# EAGLE board Z_sim_v2 (EAGLE 6.5.0)
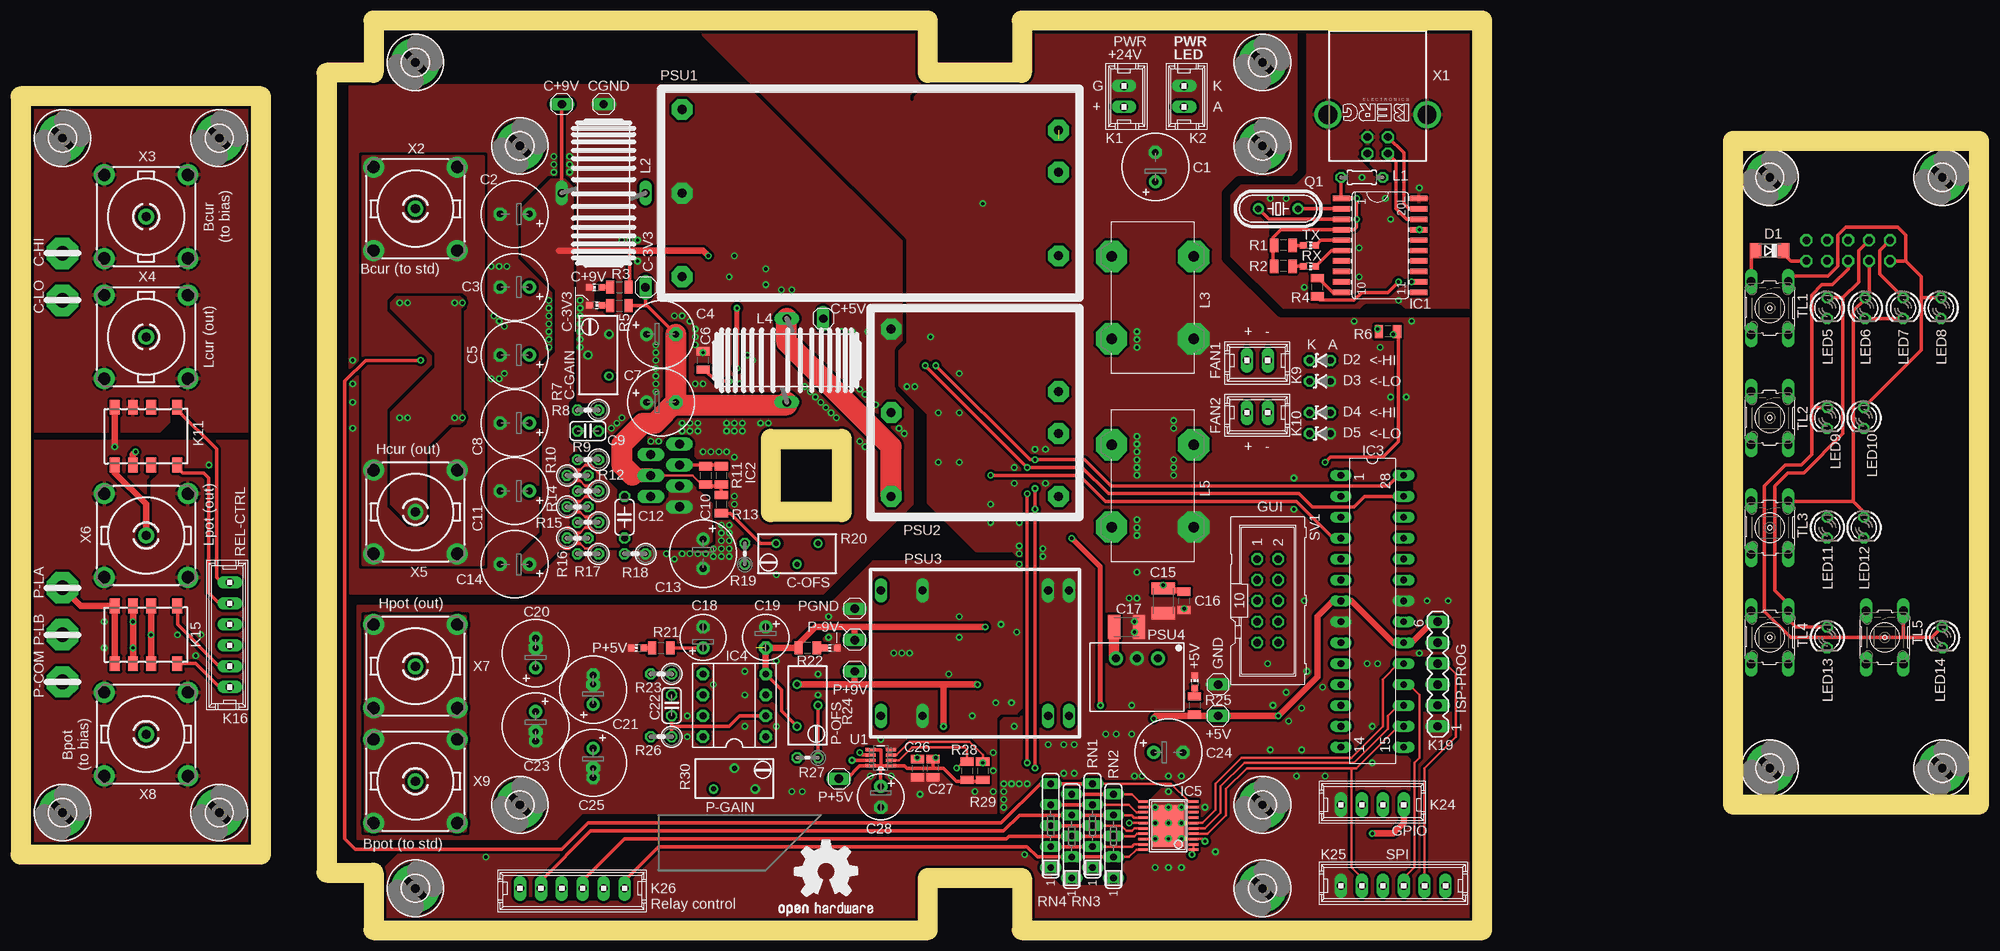
[diagram p2: board, top side]
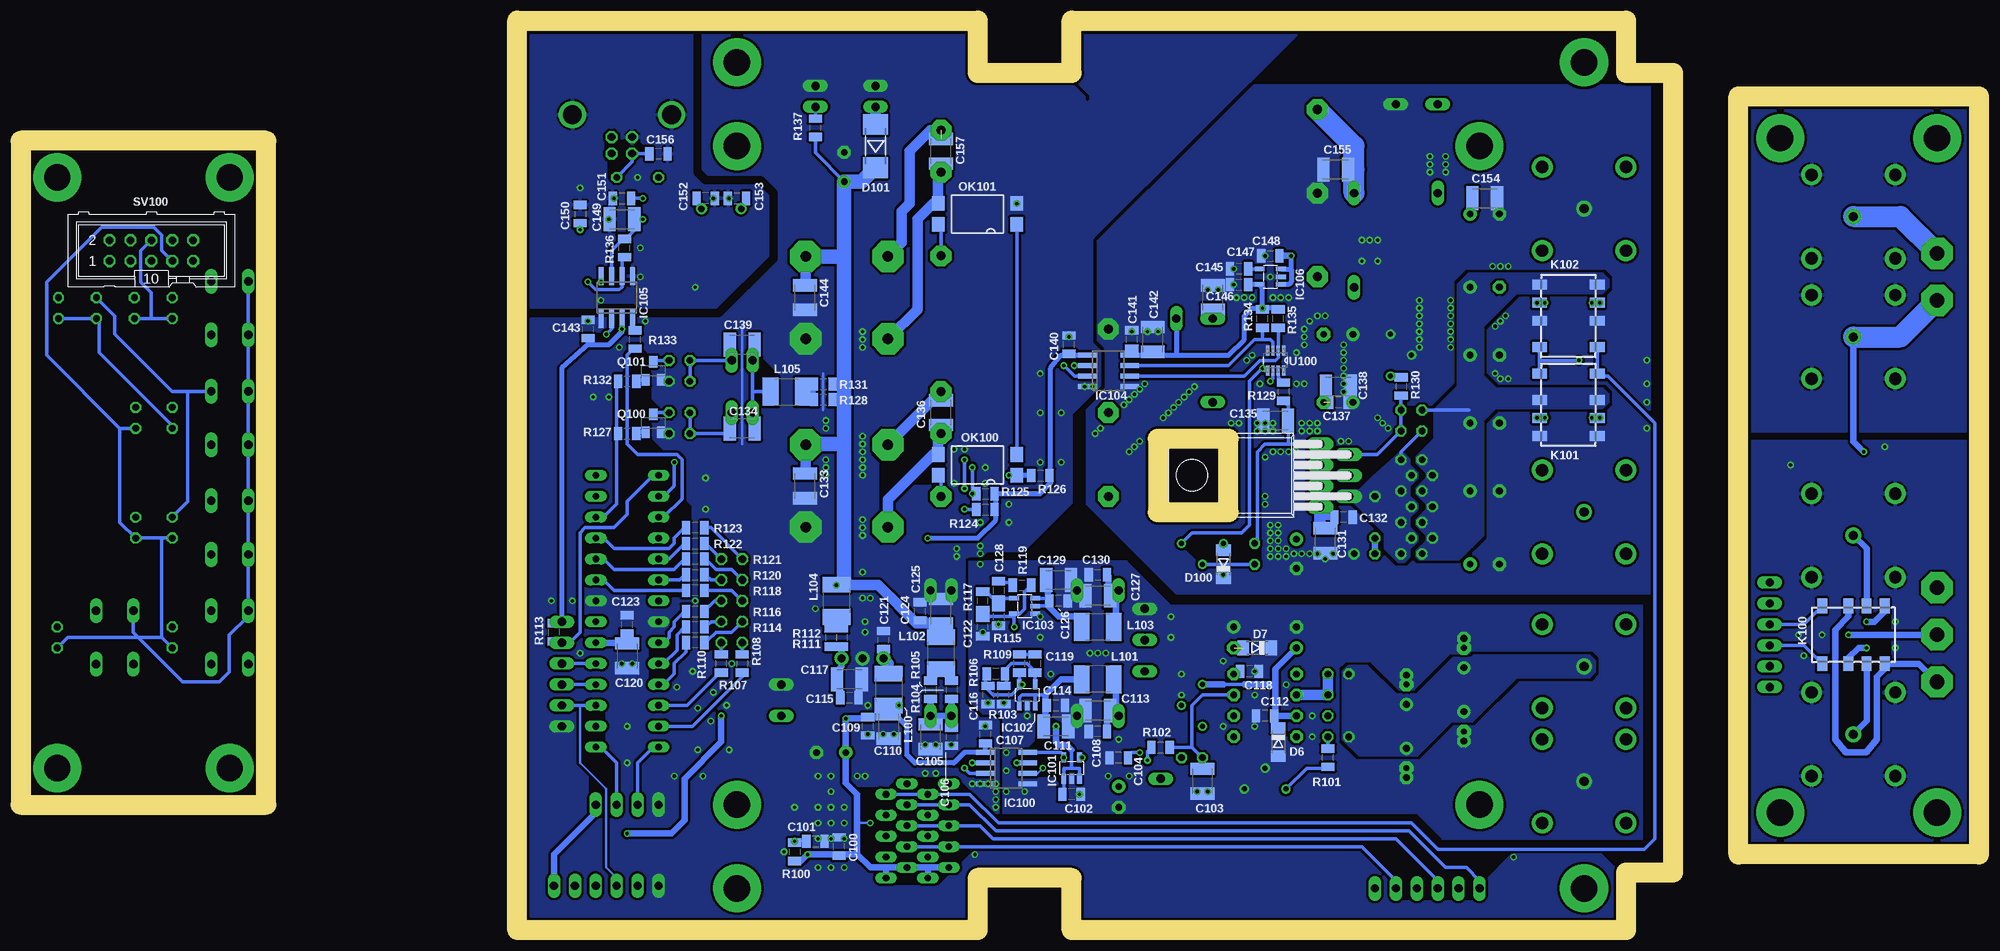
[diagram p3: board, bottom side, seen from below]

Size 237.81 x 110.49 mm. Coordinates in mm from the lower left corner, seen from the top.
Outline: 177.48,0 177.48,110.49 121.6,110.49 121.6,104.14 110.17,104.14 110.17,110.49 42.86,110.49 42.86,104.14 37.15,104.14 37.15,6.98 42.86,6.98 42.86,0 110.17,0 110.17,6.35 121.6,6.35 121.6,0 177.48,0
Outline: 91.12,59.69 99.7,59.69 99.7,50.8 91.12,50.8 91.12,59.69
Outline: 207.96,95.89 237.81,95.89 237.81,15.24 207.96,15.24 207.96,95.89
Outline: 29.21,9.21 29.21,101.28 0,101.28 0,9.21 29.21,9.21
Copper layers (1*16): Top 0.035mm / dielectric 1.5mm / Bottom 0.035mm
Design rules "default *": minimum track width 10mil, minimum drill 24mil, track to track 8mil, track to pad 8mil, pad to pad 8mil, via to via 8mil, smd to smd 8mil, copper to edge 12mil, drill to drill 8mil, minimum pad ring 10mil, minimum via ring 8mil, stop-mask expansion 4mil, vias tented up to drill 0mil, thermal gap 10mil
Net classes: 0 default: clearance 0.305 mm; 2 sup24v: clearance 0.457 mm; 3 zsim: clearance 0.305 mm
tRestrict: 75 lines
bRestrict: 89 lines

## Footprints (pad centres in the part's own frame; a part is rotated, then mirrored left to right if it is on the bottom)
E3,5-8 = drill 0.813 pad 1.6: + -1.778,0 | drill 0.813 pad 1.6 octagon: - 1.778,0
X0805 = smd 1 x 1.6: P$1 -1.111,0; P$2 1.111,0
C025-024X044 = drill 0.813 octagon: 1 -1.27,0; 2 1.27,0
C050-024X044 = drill 0.813 octagon: 1 -2.54,0; 2 2.54,0
C1210K = smd 1.5 x 2.9: 1 -1.5,0; 2 1.5,0
E2,5-6 = drill 0.813 pad 1.6: + -1.27,0 | drill 0.813 pad 1.6 octagon: - 1.27,0
SP = drill 1.016 pad 1.524 long: 1 0,0
FAST28_R = drill 1.778 pad 3.81 octagon: P$1 0,0
SOD80C = smd 1.4 x 1.8: A 1.7,0; C -1.7,0
ZDIO-2.5 = drill 0.813 octagon: A 1.27,0; C -1.27,0
MELF-MLL41 = smd 2.5 x 3: A 2.625,0; C -2.625,0
3,2-PAD = drill 3.2 pad 5.842: B3,2 0,0
SOIC20W = smd 0.66 x 2.032: 1 -6.35,-5.029; 2 -5.08,-5.029; 3 -3.81,-5.029; 4 -2.54,-5.029; 5 -1.27,-5.029; 6 0,-5.029; 7 1.27,-5.029; 8 2.54,-5.029; 9 3.81,-5.029; 10 5.08,-5.029; 11 5.08,4.394; 12 3.81,4.394; 13 2.54,4.394; 14 1.27,4.394; 15 0,4.394; 16 -1.27,4.394; 17 -2.54,4.394; 18 -3.81,4.394; 19 -5.08,4.394; 20 -6.35,4.394
TO220-7H = drill 1.1 long: 1 -3.81,-15.557; 2 -2.54,-19.05; 3 -1.27,-15.557; 4 0,-19.05; 5 1.27,-15.557; 6 2.54,-19.05; 7 3.81,-15.557
DIL28 = drill 0.813 long: 1 -16.51,-3.81; 2 -13.97,-3.81; 3 -11.43,-3.81; 4 -8.89,-3.81; 5 -6.35,-3.81; 6 -3.81,-3.81; 7 -1.27,-3.81; 8 1.27,-3.81; 9 3.81,-3.81; 10 6.35,-3.81; 11 8.89,-3.81; 12 11.43,-3.81; 13 13.97,-3.81; 14 16.51,-3.81; 15 16.51,3.81; 16 13.97,3.81; 17 11.43,3.81; 18 8.89,3.81; 19 6.35,3.81; 20 3.81,3.81; 21 1.27,3.81; 22 -1.27,3.81; 23 -3.81,3.81; 24 -6.35,3.81; 25 -8.89,3.81; 26 -11.43,3.81; 27 -13.97,3.81; 28 -16.51,3.81
DIL08 = drill 0.813 pad 1.5 octagon: 1 -3.81,-3.81; 2 -1.27,-3.81; 3 1.27,-3.81; 4 3.81,-3.81; 5 3.81,3.81; 6 1.27,3.81; 7 -1.27,3.81; 8 -3.81,3.81
TSSOP20 = smd 3.81 x 5.08: 0 0,0 | smd 1.194 x 0.305: 1 -3.048,2.925; 2 -3.048,2.275; 3 -3.048,1.625; 4 -3.048,0.975; 5 -3.048,0.325; 6 -3.048,-0.325; 7 -3.048,-0.975; 8 -3.048,-1.625; 9 -3.048,-2.275; 10 -3.048,-2.925; 11 3.048,-2.925; 12 3.048,-2.275; 13 3.048,-1.625; 14 3.048,-0.975; 15 3.048,-0.325; 16 3.048,0.325; 17 3.048,0.975; 18 3.048,1.625; 19 3.048,2.275; 20 3.048,2.925
SO8 = smd 0.6 x 2.2: 1 -1.905,-2.6; 2 -0.635,-2.6; 3 0.635,-2.6; 4 1.905,-2.6; 5 1.905,2.6; 6 0.635,2.6; 7 -0.635,2.6; 8 -1.905,2.6
SOT23-5 = smd 0.55 x 1.2: 1 -0.95,-1.3; 2 0,-1.3; 3 0.95,-1.3; 4 0.95,1.3; 5 -0.95,1.3
TE280370 = drill 1 long: 1 0,0; 2 2.54,0
G6KU-2F-Y = smd 1.2 x 1.8: 1 -3.8,-3.5; 2 -0.6,-3.5; 3 1.6,-3.5; 4 3.8,-3.5; 5 3.8,3.5; 6 1.6,3.5; 7 -0.6,3.5; 8 -3.8,3.5
TE280372 = drill 1 long: 1 -6.35,0; 2 -3.81,0; 3 -1.27,0; 4 1.27,0; 5 3.81,0; 6 6.35,0
SIL6 = drill 1.016 long: 1 -6.35,0; 2 -3.81,0; 3 -1.27,0; 4 1.27,0; 5 3.81,0; 6 6.35,0
TE280371 = drill 1 long: 1 -3.81,0; 2 -1.27,0; 3 1.27,0; 4 3.81,0
0204/5 = drill 0.813 octagon: 1 -2.54,0; 2 2.54,0
SFT830D = drill 1.016 long: 1 -5.08,0; 2 5.08,0
B1/2 = drill 1.27 pad 3.81 octagon: 1 -5,5; 2 -5,-5; 3 5,5; 4 5,-5
L1812 = smd 1.9 x 3.4: 1 -1.95,0; 2 1.95,0
CHIP-LED0603 = smd 0.8 x 0.8: A 0,-0.75; C 0,0.75
LED3MM = drill 0.813 octagon: A -1.27,0; K 1.27,0
SMD4-7 = smd 1.78 x 1.55: 1 -1.27,-4.77; 2 1.27,-4.77; 3 1.27,4.77; 4 -1.27,4.77
DCDC_AM30EW = drill 1.1 pad 2.54 octagon: 1 -22.86,-7.62; 2 -22.86,-2.54; 3 -22.86,7.62; 4 22.86,-10.16; 5 22.86,0; 6 22.86,10.16
DCDC_AM15EW = drill 1.1 pad 2.54 octagon: 1 2.54,-10.16; 2 -2.54,-10.16; 3 -10.16,-10.16; 4 10.16,10.16; 5 0,10.16; 6 -10.16,10.16
DCDC_XP_JCA_SYMOUT = drill 1 long: 2 -7.62,10.16; 3 -7.62,7.62; 9 -7.62,-7.62; 11 -7.62,-12.7; 14 7.62,-12.7; 16 7.62,-7.62; 22 7.62,7.62; 23 7.62,10.16
SIP3 = drill 1 pad 1.676: 1 -2.54,0; 2 0,0; 3 2.54,0
HC49/S = drill 0.813: 1 -2.413,0; 2 2.413,0
SOT23-BEC = smd 1 x 1.4: B -0.95,-1.1; C 0,1.1; E 0.95,-1.1
RTRIMT93YB = drill 0.61: 1 1.27,-2.54; 2 -1.27,0; 3 1.27,2.54
0207/2V = drill 0.813 octagon: 1 -1.27,0; 2 1.27,0
0204V = drill 0.813 octagon: 1 -1.27,0; 2 1.27,0
SIL5 = drill 0.813 long: 1 -5.08,0; 2 -2.54,0; 3 0,0; 4 2.54,0; 5 5.08,0
ML10 = drill 0.914 octagon: 1 -5.08,-1.27; 2 -5.08,1.27; 3 -2.54,-1.27; 4 -2.54,1.27; 5 0,-1.27; 6 0,1.27; 7 2.54,-1.27; 8 2.54,1.27; 9 5.08,-1.27; 10 5.08,1.27
CUDL1 = drill 1.016 long: 1 -3.251,2.261; 2 3.251,2.261; 3 -3.251,-2.261; 4 3.251,-2.261
SOT65P280X100-8N = smd 1.219 x 0.406: 1 -1.219,0.965; 2 -1.219,0.33; 3 -1.219,-0.33; 4 -1.219,-0.965; 5 1.219,-0.965; 6 1.219,-0.33; 7 1.219,0.33; 8 1.219,0.965
PN61729-S = drill 0.95 octagon: 1 1.25,4.71; 2 -1.25,4.71; 3 -1.25,2.71; 4 1.25,2.71 | drill 2.3 pad 2.9: S1 -6.02,0; S2 6.02,0
A1944 = drill 1.1 pad 1.93: 1 0,0 | drill 1.5 pad 2.54: 2 5.08,5.08; 3 -5.08,5.08; 4 -5.08,-5.08; 5 5.08,-5.08

## Placement (x,y rotation side)
C1  220u  [E3,5-8]  137.8,92.71 90 top
C2  470u  [E3,5-8]  60.01,87 180 top
C3  [E3,5-8]  60.01,78.11 180 top
C4  470u  [E3,5-8]  77.79,72.39 0 top
C5  [E3,5-8]  60.01,69.85 180 top
C6  1u  [X0805]  82.87,69.22 90 top
C7  470u  [E3,5-8]  77.79,64.14 0 top
C8  [E3,5-8]  60.01,61.59 180 top
C9  100p  [C025-024X044]  68.9,60.64 180 top
C10  100n  [X0805]  83.19,55.25 270 top
C11  4x470u  [E3,5-8]  60.01,53.34 180 top
C12  100n  [C050-024X044]  73.34,50.16 270 top
C13  470u  [E3,5-8]  82.87,45.72 270 top
C14  470u  [E3,5-8]  60.01,44.45 180 top
C15  10u  [C1210K]  138.75,40.01 270 top
C16  100n  [X0805]  141.29,40.01 270 top
C17  10u  [C1210K]  134.3,36.83 0 top
C18  100u  [E2,5-6]  82.87,35.56 90 top
C19  100u  [E2,5-6]  90.49,35.56 270 top
C20  [E3,5-8]  62.55,33.66 90 top
C21  [E3,5-8]  69.53,29.21 90 top
C22  100p  [C025-024X044]  79.06,27.3 90 top
C23  [E3,5-8]  62.55,24.77 270 top
C24  220u  [E3,5-8]  139.38,21.59 0 top
C25  4x470u  [E3,5-8]  69.53,20.32 270 top
C26  470p  [X0805]  108.9,19.69 270 top
C27  100n  [X0805]  110.81,19.69 90 top
C28  100u  [E2,5-6]  104.46,16.19 270 top
C100  100n  [X0805]  138.43,10.16 90 bottom
C101  100n  [X0805]  141.29,10.79 0 bottom
C102  100n  [X0805]  110.17,16.51 180 bottom
C103  10u  [C1210K]  94.3,18.1 270 bottom
C104  1u  [X0805]  104.46,20.95 180 bottom
C105  10u  [C1210K]  127.32,23.49 270 bottom
C106  100n  [X0805]  124.78,23.49 270 bottom
C107  100n  [X0805]  120.65,23.81 90 bottom
C108  100n  [X0805]  107,24.13 180 bottom
C109  100n  [X0805]  134.94,24.77 270 bottom
C110  10u  [C1210K]  132.4,24.77 270 bottom
C111  10u  [C1210K]  112.08,24.77 0 bottom
C112  100n  [X0805]  86.68,26.04 180 bottom
C113  10u  [C1210K]  107,26.67 180 bottom
C114  100n  [X0805]  112.08,27.3 0 bottom
C115  100n  [X0805]  137.16,28.26 0 bottom
C116  100n  [X0805]  120.33,28.58 270 bottom
C117  10u  [C1210K]  137.16,30.48 0 bottom
C118  100n  [X0805]  88.58,31.43 180 bottom
C119  1u  [X0805]  114.62,32.38 270 bottom
C120  10u  [C1210K]  164.15,33.34 270 bottom
C121  100n  [X0805]  133.03,35.24 90 bottom
C122  100n  [X0805]  120.97,36.83 90 bottom
C123  100n  [X0805]  164.15,37.15 90 bottom
C124  100n  [X0805]  128.59,38.73 90 bottom
C125  10u  [C1210K]  126.05,38.73 90 bottom
C126  100n  [X0805]  111.76,40.01 180 bottom
C127  10u  [C1210K]  107,40.64 0 bottom
C128  100n  [X0805]  119.06,41.27 270 bottom
C129  10u  [C1210K]  111.76,42.55 180 bottom
C130  100n  [X0805]  107,43.18 0 bottom
C131  10u  [C1210K]  79.38,47.31 270 bottom
C132  100n  [X0805]  77.15,50.16 180 bottom
C133  10u  [C1210K]  142.56,53.98 270 bottom
C134  10u  [C1210K]  150.18,60.96 0 bottom
C135  10u  [C1210K]  85.41,61.91 180 bottom
C136  10u  [C1210K]  126.05,62.87 270 bottom
C137  100n  [X0805]  77.79,64.14 0 bottom
C138  10u  [C1210K]  77.79,66.04 180 bottom
C139  10u  [C1210K]  150.18,71.12 0 bottom
C140  100n  [X0805]  110.49,71.12 90 bottom
C141  100n  [X0805]  102.87,71.75 90 bottom
C142  10u  [C1210K]  100.33,71.75 90 bottom
C143  100n  [X0805]  168.91,73.02 90 bottom
C144  10u  [C1210K]  142.56,76.84 270 bottom
C145  10u  [C1210K]  93.03,76.84 270 bottom
C146  100n  [X0805]  89.85,78.42 0 bottom
C147  470p  [X0805]  89.85,80.33 180 bottom
C148  100n  [X0805]  86.04,81.92 0 bottom
C149  4u7  [C1210K]  164.78,86.36 180 bottom
C150  100n  [X0805]  169.86,87 270 bottom
C151  100n  [X0805]  164.78,88.9 0 bottom
C152  12p  [X0805]  154.62,88.9 180 bottom
C153  12p  [X0805]  150.81,88.9 0 bottom
C154  10u  [C1210K]  60.01,88.9 0 bottom
C155  10u  [C1210K]  78.11,92.39 180 bottom
C156  100n  [X0805]  160.34,94.3 180 bottom
C157  10u  [C1210K]  126.05,94.61 270 bottom
C+5V  [SP]  97.47,74.3 0 top
C+9V  [SP]  65.72,100.33 270 top
C-3V3  [SP]  75.88,78.11 0 top
C-HI  [FAST28_R]  5.08,82.23 0 top
C-LO  [FAST28_R]  5.08,76.52 0 top
CGND  [SP]  70.8,100.33 270 top
D1  BAS32  [SOD80C]  212.41,82.55 180 top
D2  [ZDIO-2.5]  157.8,69.22 0 top
D3  [ZDIO-2.5]  157.8,66.67 0 top
D4  [ZDIO-2.5]  157.8,62.87 0 top
D5  [ZDIO-2.5]  157.8,60.33 0 top
D6  BAT42  [SOD80C]  85.09,22.86 270 bottom
D7  BAT42  [SOD80C]  87.63,34.29 180 bottom
D100  2V7  [SOD80C]  91.76,44.45 90 bottom
D101  [MELF-MLL41]  133.99,95.25 90 bottom
GOLD_ORB_SM1  OSHWLOGO_GOLD_ORB_MED  [OSHW1]  91.44,0 0 top
H1  MOUNT-PAD-ROUND3.2  [3,2-PAD]  47.94,105.41 0 top
H2  MOUNT-PAD-ROUND3.2  [3,2-PAD]  150.81,105.41 0 top
H3  MOUNT-PAD-ROUND3.2  [3,2-PAD]  5.08,96.2 0 top
H4  MOUNT-PAD-ROUND3.2  [3,2-PAD]  24.13,96.2 0 top
H5  MOUNT-PAD-ROUND3.2  [3,2-PAD]  60.64,95.25 0 top
H6  MOUNT-PAD-ROUND3.2  [3,2-PAD]  150.81,95.25 0 top
H7  MOUNT-PAD-ROUND3.2  [3,2-PAD]  212.41,91.44 0 top
H8  MOUNT-PAD-ROUND3.2  [3,2-PAD]  233.36,91.44 0 top
H9  MOUNT-PAD-ROUND3.2  [3,2-PAD]  212.41,19.69 0 top
H10  MOUNT-PAD-ROUND3.2  [3,2-PAD]  233.36,19.69 0 top
H11  MOUNT-PAD-ROUND3.2  [3,2-PAD]  60.64,15.24 0 top
H12  MOUNT-PAD-ROUND3.2  [3,2-PAD]  150.81,15.24 0 top
H13  MOUNT-PAD-ROUND3.2  [3,2-PAD]  5.08,14.29 0 top
H14  MOUNT-PAD-ROUND3.2  [3,2-PAD]  24.13,14.29 0 top
H15  MOUNT-PAD-ROUND3.2  [3,2-PAD]  47.94,5.08 0 top
H16  MOUNT-PAD-ROUND3.2  [3,2-PAD]  150.81,5.08 0 top
IC1  MCP2200S  [SOIC20W]  165.42,82.55 270 top
IC2  OPA548TH  [TO220-7H]  95.57,55.25 270 top
IC3  ATmega88  [DIL28]  164.15,38.73 270 top
IC4  OP211  [DIL08]  86.68,27.3 90 top
IC5  MAX4820  [TSSOP20]  139.38,12.7 180 top
IC100  ADUM1250  [SO8]  118.11,19.69 270 bottom
IC101  LP2985  [SOT23-5]  110.17,19.69 0 bottom
IC102  ADP7118AUJZ  [SOT23-5]  115.57,28.58 0 bottom
IC103  ADP7182AUJZ  [SOT23-5]  115.89,39.37 90 bottom
IC104  ADUM1250  [SO8]  105.73,67.94 270 bottom
IC105  ACSL-6210  [SO8]  165.42,76.84 0 bottom
IC106  LP2985  [SOT23-5]  86.04,79.38 90 bottom
K1  POWER  [TE280370]  133.99,102.55 270 top
K2  PWR LED  [TE280370]  141.29,102.55 270 top
K9  TE280370  [TE280370]  151.45,69.22 180 top
K10  TE280370  [TE280370]  151.45,62.87 180 top
K11  G6KU-2F-Y  [G6KU-2F-Y]  15.24,60.01 180 top
K15  G6KU-2F-Y  [G6KU-2F-Y]  15.24,35.88 180 top
K16  TE280372  [TE280372]  25.4,35.88 90 top
K19  ISP-prog  [SIL6]  172.08,31.12 90 top
K24  GPIO  [TE280371]  164.15,15.24 0 top
K25  SPI bus  [TE280372]  166.69,5.4 0 top
K26  RELAYS  [TE280372]  66.99,5.08 180 top
K100  G6KU-2F-Y  [G6KU-2F-Y]  15.24,35.88 0 bottom
K101  G6KU-2F-Y  [G6KU-2F-Y]  49.85,63.82 270 bottom
K102  G6KU-2F-Y  [G6KU-2F-Y]  49.85,74.61 90 bottom
L1  [0204/5]  162.88,91.44 180 top
L2  SFT830D  [SFT830D]  70.8,89.53 180 top
L3  [B1/2]  137.48,76.84 270 top
L4  SFT830D  [SFT830D]  93.03,69.22 270 top
L5  [B1/2]  137.48,53.98 270 top
L100  100u  [L1812]  132.4,29.21 270 bottom
L101  100u  [L1812]  107,30.48 180 bottom
L102  22u  [L1812]  126.05,33.66 270 bottom
L103  100u  [L1812]  107,36.83 180 bottom
L104  22u  [L1812]  138.75,40.01 270 bottom
L105  22u  [L1812]  144.78,65.41 0 bottom
LED1  [CHIP-LED0603]  156.53,83.19 270 top
LED2  [CHIP-LED0603]  156.53,80.64 270 top
LED3  [CHIP-LED0603]  69.85,78.11 90 top
LED4  [CHIP-LED0603]  69.85,75.88 270 top
LED5  [LED3MM]  219.39,75.56 270 top
LED6  [LED3MM]  224,75.56 270 top
LED7  [LED3MM]  228.6,75.56 270 top
LED8  [LED3MM]  233.2,75.56 270 top
LED9  [LED3MM]  219.39,62.23 270 top
LED10  [LED3MM]  223.84,62.23 270 top
LED11  [LED3MM]  219.39,48.9 270 top
LED12  [LED3MM]  223.84,48.9 270 top
LED13  [LED3MM]  219.39,35.56 270 top
LED14  [LED3MM]  233.36,35.56 270 top
LED15  [CHIP-LED0603]  74.93,34.29 90 top
LED16  [CHIP-LED0603]  98.42,34.29 90 top
LED17  [CHIP-LED0603]  142.56,30.16 0 top
M+5V  [SP]  145.42,26.04 90 top
MGND  [SP]  145.42,29.84 270 top
OK100  SFH618A-5X007  [SMD4-7]  121.6,56.52 90 bottom
OK101  SFH618A-5X007  [SMD4-7]  121.6,87 90 bottom
P+5V  [SP]  99.38,18.41 90 top
P+10V  [SP]  101.28,31.43 90 top
P-10V  [SP]  101.28,35.24 270 top
P-COM  [FAST28_R]  5.08,30.16 180 top
P-LA  [FAST28_R]  5.08,41.59 180 top
P-LB  [FAST28_R]  5.08,35.88 0 top
PGND  [SP]  101.28,39.05 270 top
PSU1  DCDC_AM30EW  [DCDC_AM30EW]  103.19,89.53 180 top
PSU2  DCDC_AM15EW  [DCDC_AM15EW]  115.89,62.87 90 top
PSU3  XP_JCA0224D03  [DCDC_XP_JCA_SYMOUT]  117.16,33.66 270 top
PSU4  R-78C5.0-1.0  [SIP3]  135.57,33.02 180 top
Q1  12MHz  [HC49/S]  152.72,87.63 0 top
Q100  BC817-16  [SOT23-BEC]  160.97,61.59 0 bottom
Q101  BC817-16  [SOT23-BEC]  160.97,67.94 0 bottom
R1  680  [X0805]  153.35,83.19 180 top
R2  680  [X0805]  153.35,80.64 180 top
R3  1k5  [X0805]  72.71,78.11 0 top
R4  560  [X0805]  157.48,78.11 90 top
R5  620  [X0805]  72.71,75.88 0 top
R6  1k  [X0805]  166.05,72.71 180 top
R7  500  [RTRIMT93YB]  70.17,69.85 0 top
R8  1k  [0207/2V]  68.9,63.18 180 top
R9  [0207/2V]  68.9,57.15 180 top
R10  [0207/2V]  67.63,55.25 0 top
R11  10k  [X0805]  85.09,55.25 270 top
R12  7x2R2  [0207/2V]  68.9,53.34 180 top
R13  1k  [X0805]  85.09,51.75 270 top
R14  [0207/2V]  67.63,51.44 0 top
R15  [0207/2V]  68.9,49.53 180 top
R16  [0207/2V]  67.63,47.62 0 top
R17  [0207/2V]  68.9,45.72 180 top
R18  10  [0207/2V]  74.61,45.72 180 top
R19  100k  [0204V]  87.95,45.72 90 top
R20  10k  [RTRIMT93YB]  94.3,45.72 90 top
R21  1k5  [X0805]  77.79,34.29 0 top
R22  1k5  [X0805]  95.57,34.29 180 top
R23  51  [0207/2V]  77.79,31.12 180 top
R24  50k  [RTRIMT93YB]  95.57,27.3 180 top
R25  620  [X0805]  142.56,27.3 270 top
R26  1k  [0207/2V]  77.79,23.49 180 top
R27  100k  [0204V]  95.57,20.95 180 top
R28  2k2  [X0805]  114.94,19.37 270 top
R29  2k2  [X0805]  116.84,19.37 270 top
R30  500  [RTRIMT93YB]  86.68,18.41 270 top
R100  1k  [X0805]  143.83,9.53 270 bottom
R101  510  [X0805]  79.06,20.95 90 bottom
R102  1k  [X0805]  99.38,22.23 0 bottom
R103  11k  [X0805]  118.43,28.58 90 bottom
R104  2R2  [X0805]  127.32,29.21 270 bottom
R105  2R2  [X0805]  124.78,29.21 270 bottom
R106  100k  [X0805]  119.38,31.12 180 bottom
R107  5x33R  [X0805]  152.72,32.38 90 bottom
R108  [X0805]  150.18,32.38 270 bottom
R109  1k  [X0805]  116.52,32.38 90 bottom
R110  [X0805]  155.89,34.92 180 bottom
R111  2R2  [X0805]  139.38,35.56 270 bottom
R112  2R2  [X0805]  138.11,35.56 270 bottom
R113  1k  [X0805]  173.04,36.2 90 bottom
R114  [X0805]  155.89,36.83 0 bottom
R115  11k  [X0805]  119.06,38.1 270 bottom
R116  [X0805]  155.89,38.73 0 bottom
R117  100k  [X0805]  120.97,40.01 90 bottom
R118  [X0805]  155.89,41.27 180 bottom
R119  12k  [X0805]  116.2,41.91 0 bottom
R120  [X0805]  155.89,43.18 0 bottom
R121  [X0805]  155.89,45.09 180 bottom
R122  [X0805]  155.89,46.99 0 bottom
R123  5x33R  [X0805]  155.89,48.9 180 bottom
R124  2k2  [X0805]  120.65,51.12 0 bottom
R125  2k2  [X0805]  120.65,53.02 0 bottom
R126  430  [X0805]  113.98,55.25 0 bottom
R127  10k  [X0805]  164.15,60.33 0 bottom
R128  2R2  [X0805]  140.33,64.45 0 bottom
R129  1k  [X0805]  84.45,65.41 270 bottom
R130  510  [X0805]  70.17,66.04 270 bottom
R131  2R2  [X0805]  140.33,66.36 0 bottom
R132  10k  [X0805]  164.15,66.67 0 bottom
R133  560  [X0805]  163.19,71.75 90 bottom
R134  2k2  [X0805]  87,74.3 90 bottom
R135  2k2  [X0805]  85.09,74.3 90 bottom
R136  560  [X0805]  164.46,82.87 90 bottom
R137  4k7  [X0805]  141.29,97.47 90 bottom
RN1  4x50  [SIL5]  130.18,12.7 90 top
RN2  4x50  [SIL5]  132.72,11.43 90 top
RN3  4x50  [SIL5]  127.64,11.43 90 top
RN4  4x50  [SIL5]  125.09,12.7 90 top
SV1  CONTROLS  [ML10]  151.45,40.01 270 top
SV100  CONTROLS  [ML10]  221.93,82.55 0 bottom
TL1  CUDL1_A  [CUDL1]  212.41,75.56 270 top
TL2  CUDL1_A  [CUDL1]  212.41,62.23 270 top
TL3  CUDL1_A  [CUDL1]  212.41,48.9 270 top
TL4  CUDL1_A  [CUDL1]  212.41,35.56 270 top
TL5  CUDL1_A  [CUDL1]  226.38,35.56 270 top
U1  LTC2631  [SOT65P280X100-8N]  104.46,20.95 180 top
U100  LTC2631  [SOT65P280X100-8N]  85.41,69.22 270 bottom
X1  PN61729-S  [PN61729-S]  164.78,99.06 180 top
X2  Bcur  [A1944]  47.94,87.63 0 top
X3  Bcur  [A1944]  15.24,86.68 270 top
X4  Lcur  [A1944]  15.24,72.07 270 top
X5  Hcur  [A1944]  47.94,50.8 0 top
X6  Lpot  [A1944]  15.24,47.94 180 top
X7  Hpot  [A1944]  47.94,32.07 0 top
X8  Bpot  [A1944]  15.24,23.81 180 top
X9  Bpot  [A1944]  47.94,18.1 0 top

## Tracks (layer width: path | path; a pad name or v marks a point on that pad's centre or on a via)
+5V  (via drill 0.4)
  Top 0.305: IC5.2 IC5.1 142.43,9.34 v142.24,9.21 | IC5.15 135.58,13.03 v134.62,13.02
  Top 0.406: R6.P$2 164.78,73.18 v164.78,73.02
  Top 0.61: v131.13,27.3 131.13,44.13 v127.64,47.62
  Top 0.813: K19.6 171.45,37.47 168.91,34.92 IC3.20 166.69,34.92 161.61,40.01 IC3.7 159.39,40.01 157.48,38.1 157.48,30.8 v152.72,26.04 M+5V.1 142.56,26.04 | v164.15,11.75 166.69,11.75 167.96,13.02 K24.4 | 142.56,26.04 137.8,26.04 137.6,25.84 v137.6,25.72 | R25.P$2 142.56,26.04
  Bottom 0.305: v134.62,13.02 135.89,13.02 136.21,13.34 | C100.P$1 138.11,9.05 138.11,9.21
  Bottom 0.406: R113.P$2 172.88,37.47 K19.6
  Bottom 0.61: C110.1 132.17,26.04 131.45,26.04 130.17,24.77 130.17,21.27 129.22,20.32 124.46,20.32 123.19,21.59 IC100.1 120.65,21.65 C107.P$1 | L100.2 131.17,27.26 v131.13,27.3 | v127.64,47.62 121.6,47.62 119.38,49.85 119.38,51.12 | R124.P$2 119.38,51.12 | 119.38,51.12 119.38,53.02 R125.P$2 113.98,53.02 112.71,54.29 112.71,55.09 R126.P$2 112.71,55.25 112.71,68.26 111.44,69.85 110.81,69.85 | 110.81,69.85 IC104.1 | C140.P$1 110.65,70.01 110.81,69.85 | IC105.3 v164.78,73.02 164.78,72.71 166.37,71.12 168.91,71.12 | 168.91,71.12 172.08,68.26 K19.6 | C143.P$1 168.91,71.12
  Bottom 0.813: L100.2 C110.1 132.79,25.88 C109.P$1 134.94,25.72 137.48,25.72 137.6,25.59 | K25.6 173.04,9.21 167.96,14.29 K24.4 | 136.21,9.21 136.21,13.34 136.21,16.51 137.6,17.91 C24.+ 137.6,25.59 | 136.21,9.21 138.11,9.21 v142.24,9.21 143.03,8.41 R100.P$2 | 132.72,7.62 RN1.1 127.64,7.62 | 132.72,7.62 134.62,7.62 136.21,9.21 | RN2.1 132.72,7.62 | v152.72,26.04 152.72,22.86 157.16,18.41 157.16,13.34 158.75,11.75 v164.15,11.75 | v137.6,25.72 137.6,25.59 | IC3.20 164.15,34.92 C120.1 C123.P$1 | RN4.1 127.64,7.62 | RN3.1 127.64,7.62
+5V/1  (via drill 0.4)
  Top 0.406: 110.81,19.69 107.63,19.69 107.33,19.99 U1.1 104.44,19.99 | 110.81,19.69 C27.P$2 v111.12,20.95 | R29.P$2 116.84,18.1 115.09,18.1 R28.P$2 114.46,18.26 114.3,18.1 113.67,18.1 112.08,19.69 110.81,19.69 | 104.44,19.99 U1.8 101.9,19.99 100.33,18.41 P+5V.1 | 104.44,19.99 104.46,20 104.46,21.91 103.25,21.91 U1.5 | 104.44,19.99 104.44,17.48 C28.+
  Bottom 0.406: IC100.8 111.44,21.59 111.12,21.27 IC101.5 111.09,20.98 v111.12,20.95
+5V/2  (via drill 0.4)
  Top 0.61: v87,68.26 v87,75.56
  Bottom 0.406: C146.P$2 | U100.5 86.73,68 v87,68.26 88.58,66.67 88.58,49.21 89.53,48.26 95.57,48.26 R20.1
  Bottom 0.61: C146.P$2 IC106.5 87,78.08 v87,75.56 | R135.P$2 85.09,75.56 v87,75.56 | R134.P$2 v87,75.56 | 100.33,69.85 IC104.8 102.87,70.11 C141.P$1 | 100.33,69.85 97.47,69.85 | 97.47,69.85 91.12,69.85 89.22,71.75 89.22,74.61 88.27,75.56 v87,75.56 | C142.1 100.33,69.85 | C+5V.1 97.47,69.85
+9V  (via drill 0.4)
  Top 0.305: 69.85,46.99 69.22,46.36 68.58,46.36 67.94,46.99 67.63,46.99 | 67.63,46.99 67.31,46.99 66.67,46.36 66.04,46.36 65.41,46.99 | 69.85,52.07 69.22,52.7 68.9,52.7 | 68.9,52.7 68.58,52.7 67.94,52.07 67.63,52.07 | 67.63,52.07 67.31,52.07 66.67,52.7 | 66.36,48.9 66.67,48.9 67.31,48.26 67.63,48.26 | 67.63,48.26 67.94,48.26 68.58,48.9 68.9,48.9 | 68.9,48.9 69.22,48.9 69.85,48.26 | 66.36,50.16 66.67,50.16 67.31,50.8 67.63,50.8 | 67.63,50.8 67.94,50.8 68.58,50.16 68.9,50.16 | 68.9,50.16 69.22,50.16 69.85,50.8 | 68.9,48.9 68.9,50.16 | 67.63,52.07 67.63,50.8 | 66.67,53.98 67.31,54.61 67.63,54.61 | 67.63,54.61 67.94,54.61 68.58,53.98 68.9,53.98 | 68.9,53.98 69.22,53.98 69.85,54.61 | 68.9,52.7 68.9,53.98 | 70.17,55.56 69.22,56.52 68.58,56.52 67.94,55.88 67.63,55.88 | 67.63,55.88 67.31,55.88 66.67,56.52 | 67.63,54.61 67.63,55.88 | 67.63,46.99 67.63,48.26
  Top 0.406: R3.P$2 73.98,78.11 73.98,82.55 | C+9V.1 L2.2
  Top 0.813: v83.5,81.92 82.87,82.55 73.98,82.55 65.41,82.55
  Bottom 0.61: 83.5,80.33 83.5,78.74 83.82,78.42 IC106.1 | IC106.3 83.5,80.33 | 83.5,80.33 v83.5,81.92
  Bottom 0.813: C132.P$2 80.01,50.16 | C148.P$2 v83.5,81.92 | C2.+ 61.79,88.62 C154.1
  Bottom 1.422: C131.1 79.92,48.81 80.01,48.9 80.01,50.16 IC2.5
  pour Top (no thermals): 80.96,54.61 79.06,54.61 78.42,53.98 73.03,51.75 72.39,52.39 72.39,53.34 66.36,59.37 66.36,64.14 66.99,64.77 66.99,90.17 66.04,91.12 64.45,91.12 60.96,87.63 60.96,81.92 65.09,77.79 65.09,70.17 63.5,68.58 63.5,47.94 60.96,45.4 60.96,43.82 61.28,43.5 62.55,43.5 65.41,46.36 66.67,46.36 66.99,46.67 83.19,46.67 83.82,47.31 83.82,51.75
+10V  (via drill 0.4)
  Top 0.406: C18.+ R21.P$2
  Top 0.813: R24.1 101.28,29.84 | 101.28,29.84 112.08,29.84 | 112.08,29.84 v116.2,29.84 | v112.08,24.77 112.08,29.84 | P+10V.1 101.28,29.84
  Bottom 0.406: v116.2,29.84 116.23,29.88 IC102.5 | 111.12,19.68 IC101.1 111.12,16.67 C102.P$2 | 111.12,19.68 111.12,19.69 110.17,19.69 | 110.17,19.69 109.22,19.69 IC101.3 | 111.12,19.68 110.17,19.68 110.17,19.69 | 110.17,19.69 110.17,21.91 | 91.76,29.84 89.22,29.84 | IC102.5 116.52,29.53 117.47,28.58 119.7,28.58 120.33,29.21 C116.P$1 120.49,29.69 120.65,29.84 120.65,30.96 R106.P$2 | IC102.5 R109.P$1
  Bottom 0.813: 110.17,21.91 110.81,22.54 111.76,22.54 112.08,22.86 v112.08,24.77 | R24.1 91.76,29.84 | 89.22,29.84 85.41,29.84 | 85.41,29.84 85.41,26.67 85.41,26.04 | 85.41,26.04 IC4.7 | C112.P$1 85.41,26.04 | 85.41,29.84 85.41,31.75 C18.+ | D6.C 85.41,24.56 85.41,26.04
-5V  (1 unrouted)
  Top 0.305: IC2.4 81.6,55.25 82.71,54.13 C10.P$2
  Top 0.406: R5.P$2 75.88,75.88 | 75.88,75.88 76.07,75.88 C4.- | C10.P$2 83.19,53.98 85.09,53.98 R11.P$2 R13.P$1 | C-3V3.1 75.88,75.88
  Top 1.676: IC2.4 74.3,55.25
  Top 2.54: 74.3,55.25 73.02,56.52 73.02,59.05 75.56,61.59 77.03,61.59 C7.- | C4.- C7.- | C7.- 79.69,64.14 79.69,63.82 93.03,63.82 L4.2
  Bottom 0.61: C138.2 79.57,65.76 C7.-
-10V  (via drill 0.4)  (1 unrouted)
  Top 0.406: R24.3 92.39,26.67 92.39,29.21 IC4.4
  Top 0.813: IC4.4 C19.- 93.98,34.29 | 93.98,34.29 96.52,36.83 101.28,36.83 | 101.28,36.83 v117.16,36.83 | R22.P$2 93.98,34.29 | P-10V.1 101.28,36.83
  Bottom 0.305: v117.16,36.83 117.19,36.86
  Bottom 0.406: 117.19,36.86 IC103.5 | IC103.5 116.52,38.42 115.89,39.05 115.89,41.12 R119.P$2 | IC103.5 117.19,38.13 117.16,38.1 120.81,38.1 C122.P$2 R117.P$1
  Bottom 0.813: IC4.4 89.69,31.12 C118.P$2
B0
  Bottom 0.406: R108.P$2 150.34,31.12 149.86,31.12 156.21,24.77 IC3.13
B1
  Bottom 0.406: R107.P$1 152.88,31.12 153.04,31.12 156.85,27.3 IC3.12
D0
  Bottom 0.406: R123.P$2 157.16,48.9 158.43,47.62 158.43,46.99 159.07,46.36 165.73,46.36 167.01,47.62 IC3.25
D1
  Bottom 0.406: R122.P$1 157.16,46.99 159.07,45.09 IC3.5
D2
  Bottom 0.406: R121.P$2 157.16,45.09 158.43,43.82 165.73,43.82 167.01,45.09 IC3.24
D3
  Bottom 0.406: R120.P$1 157.16,43.18 157.8,42.55 IC3.6
D4
  Bottom 0.406: R118.P$2 165.73,41.27 167.01,42.55 IC3.23
FAN
  Bottom 0.406: IC3.26 167.01,50.16 165.42,51.75 165.42,60.33 | R127.P$1 165.42,60.33 | 165.42,60.33 165.42,66.67 R132.P$1
GND  (via drill 0.4)
  Top 0.305: IC5.12 137.74,14.97 arc-90 v137.8,14.92 | IC5.9 141.02,14.97 arc90 v140.97,14.92 | IC5.18 137.76,11.07 arc90 v137.8,11.11
  Bottom 0.305: 140.33,63.18 140.33,67.63 | 150.18,59.05 150.18,73.34
  other vias: 139.38,14.92 140.97,11.11 139.38,11.11 139.38,13.02 137.8,13.02 140.97,13.02 168.91,73.98 165.1,70.8 166.37,64.77 168.27,64.77 135.57,71.75 135.57,72.71 135.57,70.8 135.57,48.9 135.57,49.85 135.57,47.94 154.62,51.12 154.62,54.93 141.29,39.05 134.94,23.81 131.76,23.81 133.03,23.81 143.83,14.92 153.99,25.4 152.08,27.3 156.21,31.43 158.12,29.53 155.57,21.91 158.43,18.73 154.94,18.73 151.76,21.91 121.28,17.78 119.38,15.88 120.65,24.77 124.78,22.54 126.68,22.54 127.95,22.54 124.14,46.36 124.14,45.4 121.28,46.67 121.28,45.72 120.65,54.29 121.28,49.53 120.65,56.2 123.19,58.42 124.46,54.29 124.46,58.42 108.58,66.04 107.63,66.04 110.49,72.07 113.98,67.63 113.98,62.87 169.86,33.66 163.51,32.38 164.78,32.38 137.8,7.62 139.38,7.62 140.97,7.62 116.84,88.27 139.38,18.73 140.97,18.73 136.21,18.73 135.25,18.73 139.38,16.83 170.81,40.01 155.89,40.01 173.36,40.01 134.94,27.3 164.15,20.32 164.15,24.77 155.57,26.99 153.67,28.89 151.45,32.38 135.25,36.2 135.25,37.47 127.95,19.05 126.68,19.05 122.24,17.78 145.1,9.53 121.92,9.21 119.38,14.92 119.38,16.83 56.52,8.89 117.79,51.75 117.79,49.53 113.98,56.83 111.44,56.83 111.44,62.87 135.57,55.25 135.57,56.2 135.57,57.15 135.57,58.1 135.57,59.05 135.57,60.01 140.02,55.25 140.02,56.2 140.02,57.15 140.02,60.96 140.02,61.91 135.57,43.5 135.57,40.32 134.62,40.32 161.93,73.98 120.33,17.78 119.38,17.78
  pour Bottom (rank 4, no thermals): 38.42,108.9 38.42,109.22 176.21,109.22 176.21,1.27 38.42,1.27
  pour Top (rank 4, no thermals): 176.21,1.27 38.42,1.27 38.42,109.22 176.21,109.22
GND1  (via drill 0.4, 0.7 pad 1.68)
  other vias: 87.95,31.43 87.95,28.58 87.95,24.77 120.97,36.2 119.06,37.15 113.98,38.1 113.98,35.56 115.57,26.04 112.71,31.12 118.43,27.62 120.33,27.62 104.46,23.18 105.73,18.73 103.19,18.73 109.22,16.51 115.89,16.83 118.11,21.59 107,33.66 106.05,33.66 107.95,33.66 121.28,44.45 69.53,29.84 62.55,34.29 62.55,24.13 69.53,19.69 118.11,19.37 118.11,16.83 91.76,32.7 91.76,24.77 84.14,29.84 80.96,23.49 80.96,26.04 93.66,16.83 94.93,16.83 96.84,28.58 96.84,31.12 98.11,35.56 98.11,38.1
  pour Bottom (rank 2, no thermals): 40.96,39.37 98.11,39.37 103.5,44.77 122.56,44.77 122.56,27.94 120.97,26.35 119.06,26.35 118.43,25.72 118.43,14.29 68.26,14.29 65.09,11.11 40.96,11.11
  pour Top (rank 2, no thermals): 40.96,39.37 98.11,39.37 103.5,44.77 122.56,44.77 122.56,27.94 120.97,26.35 119.06,26.35 118.43,25.72 118.43,14.29 68.26,14.29 65.09,11.11 40.96,11.11
GND2  (via drill 0.4)
  other vias: 102.87,72.71 100.97,72.71 99.7,72.71 92.39,77.79 93.66,77.79 90.49,78.42 90.49,80.33 86.68,81.92 82.87,70.17 88.27,69.85 87.31,66.36 81.92,66.36 85.72,61.59 86.68,61.59 86.68,60.64 85.72,60.64 82.23,61.59 82.23,60.64 81.28,60.64 81.28,61.59 89.85,61.59 91.76,43.18 76.52,59.37 78.42,45.72 80.33,45.72 79.38,45.09 85.72,58.1 84.77,58.1 83.82,58.1 82.87,58.1 85.09,49.21 86.04,49.21 85.09,48.26 86.04,48.26 64.13,70.8 64.13,71.75 64.13,72.71 64.13,73.66 64.13,74.61 64.13,75.56 64.13,76.52 58.1,80.64 57.15,80.64 59.05,80.64 58.1,73.98 57.47,74.61 58.74,73.34 58.1,66.99 57.15,66.99 58.74,67.63 67.94,76.52 67.94,75.56 67.94,74.61 67.94,73.66 67.94,72.71 67.94,71.75 67.94,70.8 77.15,65.41 77.15,66.36 77.15,67.31 77.15,68.26 77.15,69.22 77.15,70.17 77.15,71.12 88.27,76.84 85.72,76.84 84.77,76.84 83.82,76.84 89.22,76.84 90.17,76.84 95.25,66.04 95.89,65.41 96.52,64.77 97.16,64.14 97.79,63.5 98.42,62.87 99.06,62.23 101.28,66.36 101.92,65.72 102.55,65.09 103.19,64.45 103.82,63.82 81.92,71.12 81.92,72.07 81.92,73.02 81.28,73.98 80.33,74.61 79.38,74.61 71.75,60.96 72.39,61.59 73.03,62.23 86.68,51.75 101.92,59.37 102.55,58.74 103.19,58.1 106.68,60.96 107.31,60.33 88.9,69.22 40.32,69.22 74.93,81.28 73.03,81.28 73.03,83.82 73.98,83.82 74.93,83.82 64.77,92.08 66.67,92.08 66.67,93.03 64.77,93.03 64.77,93.98 66.67,93.98 40.32,66.36 40.32,64.14 40.32,60.96 77.47,59.37 86.68,57.47 87.63,60.64 87.63,61.59 90.81,61.59 86.68,52.7 85.09,47.31 86.04,47.31 85.09,46.36 86.04,46.36 84.14,46.36 84.14,45.4 85.09,45.4 86.04,45.4 83.19,45.72 82.23,45.72 81.28,45.72 80.33,61.59 80.33,60.64 82.87,66.36 86.04,79.38
  pour Top (rank 3, no thermals): 40,40.96 97.47,40.96 108.27,51.75 108.27,63.18 106.05,65.41 106.05,70.8 107.95,72.71 107.95,102.55 40,102.55
  pour Bottom (rank 3, no thermals): 40,40.96 97.47,40.96 108.27,51.75 108.27,63.18 106.05,65.41 106.05,70.8 107.95,72.71 107.95,102.55 40,102.55
GPIO0
  Bottom 0.406: IC3.14 160.97,22.23 162.88,20.32 K24.2
GPIO1
  Bottom 0.406: K24.3 165.42,20.32 167.32,22.23 IC3.15
L0
  Bottom 0.406: R116.P$1 157.16,38.73 158.43,37.47 158.43,36.83 159.07,36.2 159.07,35.56 159.7,34.92 IC3.9
L1
  Bottom 0.406: R110.P$2 157,33.81 158.43,32.38 158.43,31.12 159.7,29.84 IC3.11
L2
  Bottom 0.406: R114.P$1 157.16,36.83 158.11,35.88 158.11,33.97 159.7,32.38 IC3.10
MISO
  Top 0.305: K25.4 167.96,6.35 169.23,7.62 169.23,20.32 169.86,20.95 169.86,28.58 168.59,29.84 IC3.18
  Bottom 0.406: IC3.18 K19.3
MOSI
  Top 0.305: IC5.5 143.82,12.38 145.73,14.29 145.73,17.46 148.59,20.32 161.92,20.32 166.05,24.45 166.05,26.04 167.32,27.3 IC3.17 168.91,27.3
  Bottom 0.305: K25.3 165.42,6.35 166.69,7.62 166.69,17.14 169.86,20.32 169.86,27.3
  Bottom 0.406: IC3.17 169.86,27.3 K19.2
N$1
  Top 0.406: R11.P$1 85.09,56.52 83.19,56.52 | 83.19,56.52 IC2.3 | C10.P$1 83.19,56.52
N$2
  Bottom 0.406: OK100.4 126.05,54.92 PSU2.3
N$3
  Bottom 0.406: R19.2 87.63,47.31 87.63,58.1 86.68,59.05 83.82,59.05 | 83.82,59.05 IC2.1 | 83.82,59.05 83.82,61.91 C135.1 83.82,62 83.82,63.66 R129.P$2
N$4
  Bottom 1.27: L5.2 PSU2.1 C136.1
N$5
  Bottom 0.406: R20.2 R19.1
N$6
  Bottom 0.406: R8.2 61.91,63.18
  pour Bottom (no thermals): 66.99,47.31 66.99,47.94 68.26,49.21 68.26,49.85 66.99,51.12 66.99,51.75 68.26,53.02 68.26,53.66 66.99,54.93 66.99,55.56 68.26,56.83 68.26,57.47 66.04,59.69 66.04,63.18 63.18,66.04 63.18,78.42 61.91,79.69 45.72,79.69 45.09,79.06 45.09,78.11 45.72,77.47 56.2,77.47 60.33,73.34 60.33,67.31 58.74,65.72 45.72,65.72 45.09,65.09 45.09,64.14 45.72,63.5 58.74,63.5 60.33,61.91 60.33,47.94 63.18,45.09 67.94,45.09 68.26,45.4 68.26,46.04
N$7
  Bottom 0.813: C12.2 R18.2
N$8
  Bottom 1.27: L5.4 132.48,52.31 127,57.79 OK100.3 126.37,60 PSU2.2 C136.2
N$9
  Bottom 0.406: U100.7 85.08,67.14 R129.P$1
N$10
  Bottom 0.406: IC2.2 73.02,57.79 C9.1 R8.1 R130.P$2
N$11
  Bottom 0.406: R7.1 70.33,67.31 R130.P$1
N$12
  Top 0.406: R20.3 89.85,46.99 86.2,50.64 R13.P$2
  Bottom 0.406: D100.A R20.3
N$13  (1 unrouted)
  Bottom 1.27: L3.2 130.81,83.5 130.81,87.31 129.86,88.27 129.86,94.61 127.32,97.16 PSU1.1
N$14
  Bottom 1.27: L3.4 128.91,75.41 128.91,86.36 127,88.27 OK101.3 126.37,91.75 PSU1.2 C157.2
N$15  (via drill 0.4)
  Bottom 0.406: K101.6 45.73,62.22 v46.04,62.23 | v46.99,62.23 46.35,62.23 | K102.3 45.73,76.21 v46.04,76.2 | v46.99,76.2 46.35,76.2 | v53.66,76.2 53.36,76.2 K102.6 v52.72,76.21 v52.7,76.2 | v53.66,62.23 53.04,62.23 K101.3 52.72,62.22 v52.7,62.23
  pour Top (no thermals): 45.09,51.75 45.09,62.87 50.48,68.26 50.48,70.17 45.09,75.56 45.09,76.2 45.72,76.84 53.34,76.84 53.66,76.52 53.66,75.88 53.34,75.56 53.34,62.87 53.66,62.55 53.66,61.91 53.34,61.59 52.07,61.59 49.21,58.74 49.21,50.16 48.58,49.53 47.31,49.53
N$16
  Bottom 0.406: IC106.4 C147.P$1
N$17
  Bottom 0.305: IC105.4 163.51,73.18 R133.P$2
N$18
  Bottom 0.406: OK101.4 126.05,85.4 PSU1.3
N$19
  Bottom 0.406: OK101.1 OK100.2
N$20  (via drill 0.4)
  Top 0.406: v86.04,66.67 84.45,66.67 83.03,68.1 C6.P$1
  Bottom 0.406: U100.6 85.74,66.98 v86.04,66.67
N$21
  Bottom 0.406: C139.1 151.45,71.12 K9.1 D2.C D3.C
N$22
  Bottom 0.406: IC102.1 116.52,28.26 116.2,28.58 114.62,28.58 | 114.62,28.58 113.35,28.58 | IC102.3 114.62,28.57 114.62,28.58
  Bottom 0.813: L101.2 111.44,30.48 113.35,28.58 113.35,27.3 | 113.35,27.3 113.35,24.99 C111.1 | C114.P$1 113.35,27.3
N$23
  Bottom 0.406: IC104.6 89.22,67.31 87.31,69.22 85.41,69.22 85.08,69.55 U100.2 85.08,72.85 R135.P$1
N$24
  Bottom 0.406: U100.3 85.74,71.45 86.04,71.75 87,71.75 | R134.P$1 87,71.75 | 87,71.75 87.95,71.75 91.12,68.58 IC104.7
N$25
  Bottom 0.406: 95.57,22.23 R27.2 C103.1 | IC4.3 94.3,28.58 95.57,27.3 95.57,22.23 | R102.P$2 95.57,22.23
N$26
  Top 0.406: R27.1 R24.2
N$27  (via drill 0.4)
  Top 0.406: U1.7 101.3,20.62 v100.97,20.64
  Bottom 0.406: 101.12,20.64 v100.97,20.64 100.97,21.75 R102.P$1
N$28
  Bottom 1.27: IC4.6 C22.2 R23.1
N$29  (via drill 0.4)
  Top 0.406: U1.6 102.25,21.29 v101.92,21.59
  Bottom 0.406: v101.92,21.59 102.87,21.59 103.03,21.43 103.03,21.27 C104.P$1
N$30  (via drill 0.4)
  Top 0.305: U1.2 106.67,20.62 108.27,22.23 114.62,22.23 114.94,21.91 R28.P$1 114.46,20.48 v113.67,19.69
  Bottom 0.305: IC100.6 114.3,19.05 v113.67,19.69
N$31  (via drill 0.4)
  Top 0.305: U1.3 106.38,21.29 107.95,22.86 115.25,22.86 116.84,21.27 R29.P$1 116.68,20.32 v116.84,20.32
  Bottom 0.305: IC100.7 v116.84,20.32
N$32
  Bottom 0.406: IC103.3 113.35,40.32 113.03,40.64 | IC103.2 113.03,39.37 | C126.P$2 113.03,40.01
  Bottom 0.813: L103.2 108.95,37.51 109.54,38.1 111.76,38.1 113.03,39.37 113.03,40.01 113.03,40.64 113.03,42.31 C129.2
N$33
  Bottom 0.813: L103.1 104.78,36.83 104.78,40.64 | 104.78,40.64 104.78,40.96 PSU3.11 105.73,41.27 105.73,43.02 C130.P$2 | C127.2 104.78,40.64
N$34
  Bottom 0.813: PSU3.14 104.78,26.35 104.78,26.67 | 104.78,26.67 104.78,29.84 105.05,30.12 L101.1 | 104.78,26.67 C113.1 105.41,26.58 105.41,26.04 105.89,25.56 C108.P$1
N$35
  pour Bottom (no thermals): 46.67,31.43 46.67,32.7 47.31,33.34 61.28,33.34 61.59,33.02 63.82,33.02 68.26,28.58 70.8,28.58 74.3,32.07 76.52,32.07 77.15,31.43 77.15,23.18 75.25,21.27 68.26,21.27 64.13,25.4 61.59,25.4 56.2,30.8 47.31,30.8
N$36
  Bottom 0.406: IC103.4 119.06,40.32 C128.P$2 | R115.P$1 C128.P$2 | C128.P$2 119.06,40.32 119.7,40.32 120.49,41.12 R117.P$2
N$37
  Bottom 0.406: R119.P$1 117.63,42.23 118.43,42.23 118.59,42.39 C128.P$1
N$38
  Bottom 0.406: R103.P$2 118.27,29.69 118.11,29.84 118.11,30.96 R106.P$1 118.27,31.59 117.47,32.38 115.57,32.38 114.62,31.43 C119.P$2 IC102.4
N$39
  Bottom 0.406: C119.P$1 | C119.P$1 R109.P$2
N$40
  Bottom 0.406: D2.A 160.97,69.22 Q101.C
N$41
  Bottom 0.813: R105.P$1 126.05,31.59 | R104.P$1 126.05,31.59 | 126.05,31.59 L102.2
N$42
  Bottom 0.813: PSU3.23 R104.P$2 | C106.P$1 PSU3.22 | C105.1 PSU3.23 | R105.P$2 PSU3.22 | PSU3.22 PSU3.23
N$45
  Top 0.406: IC4.2 87.31,26.04 86.04,24.77 79.06,24.77 | 79.06,24.77 C22.1 | 79.06,24.77 R26.1
  Bottom 0.406: R101.P$2 R26.1
N$46
  Bottom 0.406: R101.P$1 79.06,19.69 81.6,19.69 R30.1
N$47
  Bottom 0.406: K10.1 151.45,61.19 C134.1 151.68,60.33 D5.C D4.C
N$48  (via drill 0.4)
  Top 0.305: C26.P$1 109.06,20.95 v108.9,20.95
  Bottom 0.305: v108.9,20.95 108.61,20.98 IC101.4
N$49
  pour Top (no thermals): 41.91,13.02 41.91,38.1 53.98,38.1 53.98,12.06 41.91,12.06
N$50
  Bottom 0.406: Q101.B 163.04,66.84 R132.P$2
N$51
  Bottom 0.813: R111.P$2 R112.P$2 PSU4.1 138.11,32.07 138.75,31.43 138.75,30.48 C117.1 138.43,30.48 138.43,27.94 C115.P$1
N$52
  Bottom 1.27: K1.2 D101.A
N$53
  Bottom 0.813: L104.2 138.75,37.31 138.67,37.23 | 138.67,37.23 R112.P$1 | R111.P$1 139.22,36.67 138.67,37.23
N$54
  Bottom 0.406: C9.2 70.17,58.1 R9.1
  pour Bottom (no thermals): 77.79,53.02 77.47,53.34 75.25,53.34 73.66,54.93 70.8,57.47 70.48,57.79 69.85,57.79 69.22,57.15 69.22,56.52 68.26,55.56 68.26,54.93 69.22,53.98 69.22,52.7 68.26,51.75 68.26,51.12 69.22,50.16 69.22,48.9 68.26,47.94 68.26,47.31 69.22,46.36 69.22,45.4 69.85,44.77 70.48,44.77 72.07,46.36 72.07,48.26 75.88,52.07 77.47,52.07 77.79,52.39
N$55
  Top 1.27: C17.1 132.8,33.25 PSU4.3
  Bottom 0.813: C121.P$1 PSU4.3
  Bottom 1.27: L100.1 132.4,32.38 PSU4.3
N$56
  pour Top (rank 2, no thermals): 41.59,44.45 56.2,44.45 56.2,93.98 41.59,93.98
N$57  (via drill 0.4)
  Top 0.305: IC5.3 143.55,11.07 v143.83,10.79
  Bottom 0.305: R100.P$1 143.67,10.79 v143.83,10.79 C101.P$1
N$58
  Bottom 0.406: D4.A 160.97,62.87 Q100.C
N$59
  Bottom 0.406: Q100.B 163.04,60.5 R127.P$2
N$60
  Bottom 0.406: R137.P$2 K2.2
N$61
  Bottom 0.406: SV1.2 154.62,46.99 R122.P$2
N$62
  Bottom 0.406: R120.P$2 154.62,43.18 153.99,42.55 SV1.4
N$63
  Top 0.406: IC1.2 Q1.2
  Bottom 0.406: C152.P$2 155.73,88.23 Q1.2
N$64
  Top 0.406: IC1.3 151.57,86.36 Q1.1
  Bottom 0.406: C153.P$2 149.7,88.23 Q1.1
N$65
  Bottom 0.406: L1.1 163.53,93.33 X1.1 163.48,94.3 C156.P$2
N$66
  Bottom 0.406: SV1.1 153.99,48.9 R123.P$1
N$67
  Bottom 0.406: SV1.3 151.45,43.82 153.35,43.82 154.62,45.09 R121.P$1
N$68
  Top 0.406: X1.2 167.01,93.38 167.01,87.63 168.27,86.36 IC1.18
N$69
  Top 0.406: X1.3 167.96,94.42 167.96,88.27 168.59,87.63 IC1.19
N$70  (via drill 0.4)
  Top 0.406: v169.86,85.09 IC1.17
  Bottom 0.406: C150.P$2 v169.86,85.09
N$71  (via drill 0.4)
  Top 0.406: L1.2 160.34,88.95 IC1.1 v162.24,88.9 v162.24,86.36 162.24,85.41 161.92,85.09 IC1.4 153.04,85.09 152.08,84.14 152.08,83.34 R1.P$2 152.08,83.03 152.08,80.96 152.24,80.8 R2.P$2
  Bottom 0.406: v162.24,88.9 C151.P$2 | v162.24,86.36 C149.1 163.28,85 164.31,83.98 R136.P$2 164.94,83.66 166.05,82.55 IC105.7
N$72
  Top 0.406: R1.P$1 LED1.A
N$73
  Top 0.406: R2.P$1 LED2.A
N$74
  Top 0.406: IC1.5 157.91,83.82 LED1.C
N$75
  Top 0.406: IC1.6 159.18,82.55 LED2.C
N$76  (via drill 0.4)
  Top 0.406: v168.91,78.74 IC1.12
  Bottom 0.406: v168.91,78.74 167.96,77.79 165.1,77.79 164.78,78.11 IC105.6 164.78,81.44 R136.P$1
N$77
  Bottom 0.406: R118.P$1 151.45,41.27 SV1.5
N$78
  Top 0.406: R4.P$2 158.11,78.74 159.39,77.47 IC1.10
N$79  (via drill 0.4)
  Top 0.406: v167.32,78.74 166.05,77.47 162.88,77.47 161.92,76.52 157.8,76.52 157.64,76.68 R4.P$1
  Bottom 0.406: IC105.8 v167.32,78.74
N$80  (via drill 0.4)
  other vias: 167.32,76.52 169.86,90.17 162.88,91.44 166.37,86.36 165.74,88.9 151.76,88.9 153.67,88.9 162.56,79.38 155.89,78.11 162.56,82.87
  pour Top: 153.35,75.56 175.89,75.56 176.21,109.22 155.89,109.22 155.89,91.76 154.62,90.49 147.95,90.49 146.69,89.22 146.69,82.23
  pour Bottom: 153.35,75.56 175.89,75.56 176.21,109.22 155.89,109.22 155.89,91.76 154.62,90.49 154.31,90.49 148.27,90.49 147.95,90.49 146.69,89.22 146.69,82.23
N$81
  Bottom 0.406: R116.P$2 153.51,40.01 SV1.6
N$82
  Bottom 0.406: SV1.8 153.99,37.47 154.62,36.83 R114.P$2
N$83
  Bottom 0.406: SV1.7 151.45,36.2 153.35,36.2 154.3,35.24 154.46,35.24 R110.P$1
N$84
  Bottom 0.406: SV1.10 R107.P$2
N$85
  Bottom 0.406: SV1.9 R108.P$1
N$86
  Top 0.406: LED3.A R3.P$1
N$87
  Top 0.406: LED4.C R5.P$1
N$88
  Top 0.406: R25.P$1 LED17.A
N$89
  Top 0.406: R21.P$1 LED15.A
N$90
  Top 0.406: R22.P$1 LED16.C
N$91
  Top 0.406: 228.92,81.28 230.82,79.38 230.82,76.84 | 232.09,76.84 LED8.A 230.82,76.84 | 230.82,76.84 230.82,70.48 LED10.A | TL1.1 214.95,79.38 215.02,79.45 219.47,79.45 220.66,80.64 220.66,84.45 221.61,85.41 227.96,85.41 228.92,84.45 228.92,81.28 | 228.92,81.28 SV100.1
N$92
  Top 0.406: SV100.2 225.74,82.55 225.74,79.69 LED7.A
  Bottom 0.406: 214.67,65.41 214.67,65.44 | LED11.A 217.49,52.07 217.49,65.41 | TL2.1 214.67,65.44 | 214.67,65.44 215.27,65.41 217.49,65.41 | 217.49,65.41 219.39,65.41 226.38,72.39 226.38,74.61 LED7.A
N$93
  Top 0.406: SV100.3 224.47,77.47 LED6.A 224,76.68 222.57,75.25 222.57,52.07 | 222.57,52.07 214.67,52.07 TL3.1 | 222.57,52.07 223.84,50.8 LED12.A
N$94
  Top 0.406: SV100.4 223.2,82.55 223.2,78.74 221.3,76.84 | LED5.A 221.3,76.84 | 221.3,76.84 221.3,60.33 216.54,55.56 214.63,55.56 213.04,53.98 213.04,41.27 214.67,39.65 TL4.1 214.67,37.74 215.58,36.83 LED13.A
N$95
  Top 0.406: 217.49,63.5 217.49,77.15 218.76,78.42 220.03,78.42 221.93,80.33 SV100.5 | LED9.A 217.49,63.5 | 217.49,63.5 217.49,57.79 216.22,56.52 214.31,56.52 211.77,53.98 211.77,38.73 214.95,35.56 228.64,35.56 | 228.64,35.56 TL5.1 | LED14.A 232.09,35.56 228.64,35.56
N$96  (via drill 0.4)
  Top 0.813: K15.2 v15.84,35.88 K15.7
  Bottom 0.813: P-LB.P$1 v15.84,35.88
N$97
  Top 0.813: K15.5 K15.4 7.29,39.38 P-LA.P$1
N$98
  Top 0.406: D1.A 210.15,82.55 TL1.3
  Bottom 0.406: TL5.3 224.15,38.73 224.15,36.2 218.12,30.16 213.68,30.16 212.45,31.39 212.45,35.84 210.18,38.1 TL4.3 TL3.3 210.15,65.41 TL2.3 TL1.3
N$99
  Top 0.406: SV100.9 214.95,81.28 214.31,81.92 D1.C
N$100
  Top 0.406: LED7.K LED6.K
  Bottom 0.406: LED8.K LED7.K 228.28,74.3 228.28,70.17 219.39,61.28 LED9.K | LED6.K 221.93,74.3 | 221.93,74.3 LED5.K | SV100.6 223.2,82.55 223.2,78.74 221.93,77.47 221.93,74.3
N$101
  Bottom 0.406: 225.74,60.96 225.74,49.53 LED12.K LED11.K 220.66,47.62 220.66,35.56 | 225.74,60.96 234.63,69.85 234.63,78.74 227.96,85.41 221.61,85.41 220.66,84.45 220.66,82.55 SV100.7 | LED10.K 225.74,60.96 | LED13.K 220.66,35.56 | 220.66,35.56 232.09,35.56 LED14.K
N$102  (via drill 0.4)
  Top 0.813: K15.3 arc-90 13.65,39.37 v13.65,37.47 v13.65,34.29 13.65,33.02 arc90 13.64,33.01 K15.6
  Bottom 0.813: K100.5 11.44,38.73 12.7,37.47 v13.65,37.47 | K100.2 15.84,33.05 14.6,34.29 v13.65,34.29
N$103
  Bottom 0.813: K100.3 13.64,25.41 X8.1
N$104
  Bottom 0.813: P-COM.P$1 7.29,32.38 K100.4 11.43,31.75 12.38,30.8 12.38,23.18 13.65,21.59 16.19,21.59 17.46,23.18 17.46,36.48 15.87,38.1 15.87,39.34 K100.7
N$105
  Bottom 0.406: K16.4 21.27,37.15 K100.8
N$106
  Bottom 0.406: 148.91,65.41 K9.2 148.91,71.12 C139.2 | 148.91,65.41 K10.2 148.91,60.96 C134.2 | L105.1 148.91,65.41
N$107
  Top 0.813: K11.5 11.44,55.55 15.24,51.75 X6.1
  Bottom 0.813: K100.6 13.64,46.34 X6.1
N$108  (via drill 0.4)
  Top 0.813: K11.4 11.44,59.07 11.43,59.05
  other vias: 19.05,35.88 10.16,37.47 10.16,34.29 21.27,33.34 21.91,35.88 22.86,56.52 11.43,58.74
  pour Bottom: 1.27,59.37 27.94,59.37 27.94,10.48 1.27,10.48
  pour Top: 1.27,59.37 27.94,59.37 27.94,10.48 1.27,10.48
N$109
  Bottom 0.406: R128.P$1 141.45,65.41 | R131.P$1 141.45,65.41 | 141.45,65.41 L105.2
N$110  (via drill 0.4)
  Top 0.813: C15.1 v138.75,41.91 | C16.P$1 141.13,41.27 139.38,41.27 v138.75,41.91 | v138.75,41.91 L104.1
  Bottom 0.406: R137.P$1 141.29,94.42 C1.+
  Bottom 0.813: v138.75,41.91 L104.1 | C124.P$1 127.79,37.62 127.41,37.23 C125.1 L102.1
  Bottom 1.016: R131.P$2 137.8,66.36 | R128.P$2 137.8,64.45
  Bottom 1.27: 138.11,41.95 133.67,41.95 | 133.67,41.95 L104.1 | 142.48,59.05 L5.1 142.48,55.48 C133.1 | L3.1 142.48,78.34 C144.1 | 133.67,41.95 131.08,39.37 131.13,39.37 128.99,37.23 C125.1
  Bottom 1.778: 137.8,81.84 C1.+ 135.68,90.93 D101.C | 137.8,81.84 L3.1 | 137.8,81.84 137.8,66.36 137.8,64.45 137.8,59.05 | 137.8,59.05 137.8,42.23 138.11,42.23 138.11,41.95 | 142.48,59.05 137.8,59.05
N$111
  Bottom 2.54: X3.1 9.52,86.68 C-HI.P$1
N$112  (via drill 0.4)
  Top 0.813: K11.6 13.64,57.77 v13.97,58.1
  Bottom 0.813: X4.1 15.24,59.37 v13.97,58.1
  Bottom 2.54: X4.1 9.52,72.07 C-LO.P$1
N$113
  pour Bottom: 27.94,60.64 27.94,100.01 1.27,100.01 1.27,60.64
  pour Top: 27.94,60.64 1.27,60.64 1.27,100.01 27.94,100.01
N$114
  Top 0.406: K16.2 24.13,32.07 19.05,37.15 19.05,39.37 K15.1
N$115
  Top 0.406: K16.1 24.13,29.53 21.27,32.38 K15.8
N$117
  Bottom 0.406: K16.3 21.27,34.61 K100.1
N$118
  Top 0.406: K11.1 19.04,63.19 23.81,58.42 23.81,42.86 24.45,42.23 K16.6
N$119
  Top 0.406: K16.5 24.13,39.69 22.86,40.96 22.86,54.93 22.22,55.56 19.68,55.56 19.04,56.21 K11.8
PBIAS  (via drill 0.4)
  Top 0.406: v117.79,55.25 128.59,55.25 131.76,52.07 154.94,52.07 159.39,47.62 IC3.4
  Bottom 0.406: OK100.1 v117.79,55.25
  Bottom 0.61: R126.P$1 OK100.1
RE1A
  Top 0.305: IC5.20 135.5,9.78 134.62,8.89 RN2.2
  Top 0.406: RN2.2 RN3.2 123.51,8.89 122.24,10.16 77.47,10.16 73.34,6.03 K26.1
RE1B
  Top 0.305: IC5.19 135.2,10.43 134.94,10.16 RN1.2
  Top 0.406: RN1.2 RN4.2
  Bottom 0.406: RN1.2 74.93,10.16 70.8,6.03 K26.2
RE2A
  Top 0.305: IC5.17 135.55,11.72 135.25,11.43 RN2.3
  Top 0.406: RN2.3 RN3.3 120.02,11.43 119.7,11.11 73.34,11.11 68.26,6.03 K26.3
RE2B
  Top 0.305: IC5.16 135.25,12.38 134.94,12.06 134.3,12.06 133.67,12.7 RN1.3
  Top 0.406: RN4.3 RN1.3
  Bottom 0.406: RN1.3 121.28,12.7 119.7,11.11 70.8,11.11 65.72,6.03 K26.4
RE3A
  Top 0.305: IC5.14 135.23,13.68 134.94,13.97 RN2.4
  Top 0.406: RN2.4 RN3.4 121.28,13.97 119.38,12.06 69.22,12.06 63.18,6.03 K26.5
RE3B
  Top 0.305: IC5.13 135.53,14.32 134.62,15.24 RN1.4
  Top 0.406: RN4.4 RN1.4
  Bottom 0.406: RN1.4 122.56,15.24 119.38,12.06 69.22,12.06 64.77,7.62 62.23,7.62 60.64,6.03 K26.6
RE4A
  Top 0.305: IC5.11 135.82,15.62 134.94,16.51 RN2.5
  Top 0.406: RN3.5 RN2.5
  Bottom 0.406: K102.1 K101.8 46.04,67.31 45.72,67.31 45.07,67.3 39.37,61.59 39.37,11.11 40.64,9.84 65.72,9.84 68.9,13.02 119.06,13.02 122.56,16.51 RN2.5
RE4B  (via drill 0.4)
  Top 0.305: RN1.5 139.7,17.78 141.86,15.62 IC5.10
  Top 0.406: RN1.5 RN4.5 123.83,17.78 119.06,13.02 68.9,13.02 65.72,9.84 40.64,9.84 39.37,11.11 39.37,66.67 41.91,69.22 v48.59,69.22
  Bottom 0.406: K101.1 53.35,69.21 53.34,69.22 | v48.59,69.22 53.34,69.22 | 53.34,69.22 53.35,69.22 K102.8
RST
  Bottom 0.406: R113.P$1 172.88,34.92 K19.5 171.13,34.92 169.86,36.2 169.86,48.26 169.23,48.9 165.73,48.9 164.15,50.48 164.15,52.07 160.97,55.25 IC3.1
RXD  (via drill 0.4)
  Top 0.406: v158.43,56.83 159.07,57.47 165.42,57.47 167.32,59.37 167.32,72.39 | 167.32,72.39 167.32,72.87 R6.P$1 | v166.69,72.39 167.32,72.39
  Bottom 0.406: IC3.2 159.7,52.7 158.43,53.98 v158.43,56.83 | IC105.2 166.05,73.02 v166.69,72.39
SCK
  Top 0.305: IC5.6 143.52,13.03 145.1,14.61 145.1,17.78 148.27,20.95 161.61,20.95 165.42,24.77 165.42,30.48 167.32,32.38 IC3.19 | K25.5 170.5,19.69 174.31,23.49 174.31,31.12 173.04,32.38 K19.4
  Bottom 0.406: IC3.19 K19.4
SCL  (via drill 0.4)
  Top 0.406: v111.12,68.58 122.56,57.15 v123.19,57.15 129.22,57.15 132.4,53.98 166.05,53.98 167.32,55.25 IC3.28 | v123.19,19.69 v123.19,51.12 v123.19,53.66
  Bottom 0.406: IC104.3 109.86,67.31 v111.12,68.58 | IC100.3 122.56,19.05 v123.19,19.69 | v123.19,53.66 v123.19,57.15 | R124.P$1 v123.19,51.12
SDA  (via drill 0.4)
  Top 0.406: IC3.27 163.2,52.7 161.92,51.44 156.85,51.44 155.26,53.02 132.08,53.02 128.91,56.2 v122.24,56.2 v109.86,68.58 | v122.24,20.32 v122.24,53.02
  Bottom 0.406: v109.86,68.58 IC104.2 | IC100.2 v122.24,20.32 | v122.24,56.2 v122.24,53.02 R125.P$1
SS
  Top 0.305: IC5.4 144.12,11.72 146.37,13.97 146.37,17.14 148.91,19.69 161.61,19.69 | IC3.16 167.32,24.77 162.24,19.69 161.61,19.69 | 161.61,19.69 161.61,7.62 162.88,6.35 K25.2
TXD
  Bottom 0.406: IC3.3 159.7,50.16 157.48,52.39 157.48,57.15 158.11,57.79 162.88,57.79 164.15,59.05 164.15,69.85 163.35,70.64 R133.P$1
VOUT+
  Bottom 0.813: C155.1 75.88,92.39
  Bottom 2.54: L2.1 75.88,92.39 75.88,95.25 PSU1.4
VOUT-
  Top 2.54: PSU2.6 105.73,58.74 93.03,71.44 L4.1
  Bottom 0.406: C145.2 L4.1

## Text on the board
tNames: PWR | PWR | +24V | LED | C+9V | CGND | G | K | + | A | Bcur / (to bias) | TX | RX | Bcur (to std) | C+9V | C-3V3 | C-3V3 | Lcur (out) | + | - | K | A | <-HI | FAN1 | <-LO | C-GAIN | <-HI | FAN2 | <-LO | Hcur (out) | + | - | Lpot (out) | GUI | REL-CTRL | C-OFS | PGND | Hpot (out) | P-9V | P+5V | +5V | GND | P+9V | ISP-PROG | +5V | Bpot / (to bias) | P-OFS | P+5V | P-GAIN | GPIO | Bpot (to std) | SPI | Relay control
tDocu: heatsink | heatsink | heatsink | heatsink | Mutual Inductance Z / Simulator V1.0 / CMI, 2019-08-01 / smaslan@cmi.cz | CERN OHL License V1.2